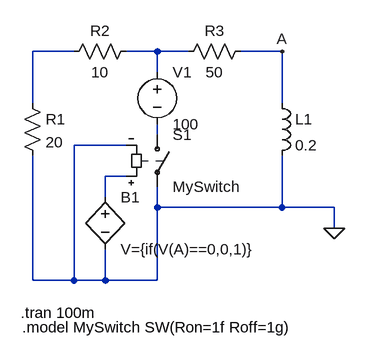
[diagram p0: schematic Draft2.asc]
Draft2.asc, the LTspice schematic file:
Version 4
SHEET 1 880 680
WIRE 144 64 80 64
WIRE 272 64 224 64
WIRE 320 64 272 64
WIRE 464 64 400 64
WIRE 272 96 272 64
WIRE 80 144 80 64
WIRE 464 144 464 64
WIRE 272 192 272 176
WIRE 224 208 144 208
WIRE 224 256 192 256
WIRE 192 288 192 256
WIRE 272 304 272 272
WIRE 464 304 464 224
WIRE 464 304 272 304
WIRE 544 304 464 304
WIRE 544 336 544 304
WIRE 80 416 80 224
WIRE 144 416 144 208
WIRE 144 416 80 416
WIRE 192 416 192 368
WIRE 192 416 144 416
WIRE 272 416 272 304
WIRE 272 416 192 416
FLAG 544 336 0
FLAG 464 64 A
SYMBOL res 64 128 R0
SYMATTR InstName R1
SYMATTR Value 20
SYMBOL res 240 48 R90
WINDOW 0 0 56 VBottom 2
WINDOW 3 32 56 VTop 2
SYMATTR InstName R2
SYMATTR Value 10
SYMBOL res 416 48 R90
WINDOW 0 0 56 VBottom 2
WINDOW 3 32 56 VTop 2
SYMATTR InstName R3
SYMATTR Value 50
SYMBOL voltage 272 80 R0
WINDOW 123 0 0 Left 0
WINDOW 39 0 0 Left 0
SYMATTR InstName V1
SYMATTR Value 100
SYMBOL ind 448 128 R0
SYMATTR InstName L1
SYMATTR Value 0.2
SYMATTR SpiceLine Rser=0.001p
SYMBOL sw 272 176 R0
SYMATTR InstName S1
SYMATTR Value MySwitch
SYMBOL bv 192 272 R0
SYMATTR InstName B1
SYMATTR Value V={if(V(A)==0,0,1)}
TEXT 62 466 Left 2 !.tran 100m
TEXT 64 488 Left 2 !.model MySwitch SW(Ron=1f Roff=1g)

The netlist it stands for:
* Draft2.asc
R1 N001 0 20
R2 N002 N001 10
R3 A N002 50
V1 N002 N003 100
L1 A 0 0.2 Rser=0.001p
S1 N003 0 N004 0 MySwitch
B1 N004 0 V={if(V(A)==0,0,1)}
.tran 100m
.model MySwitch SW(Ron=1f Roff=1g)
.backanno
.end